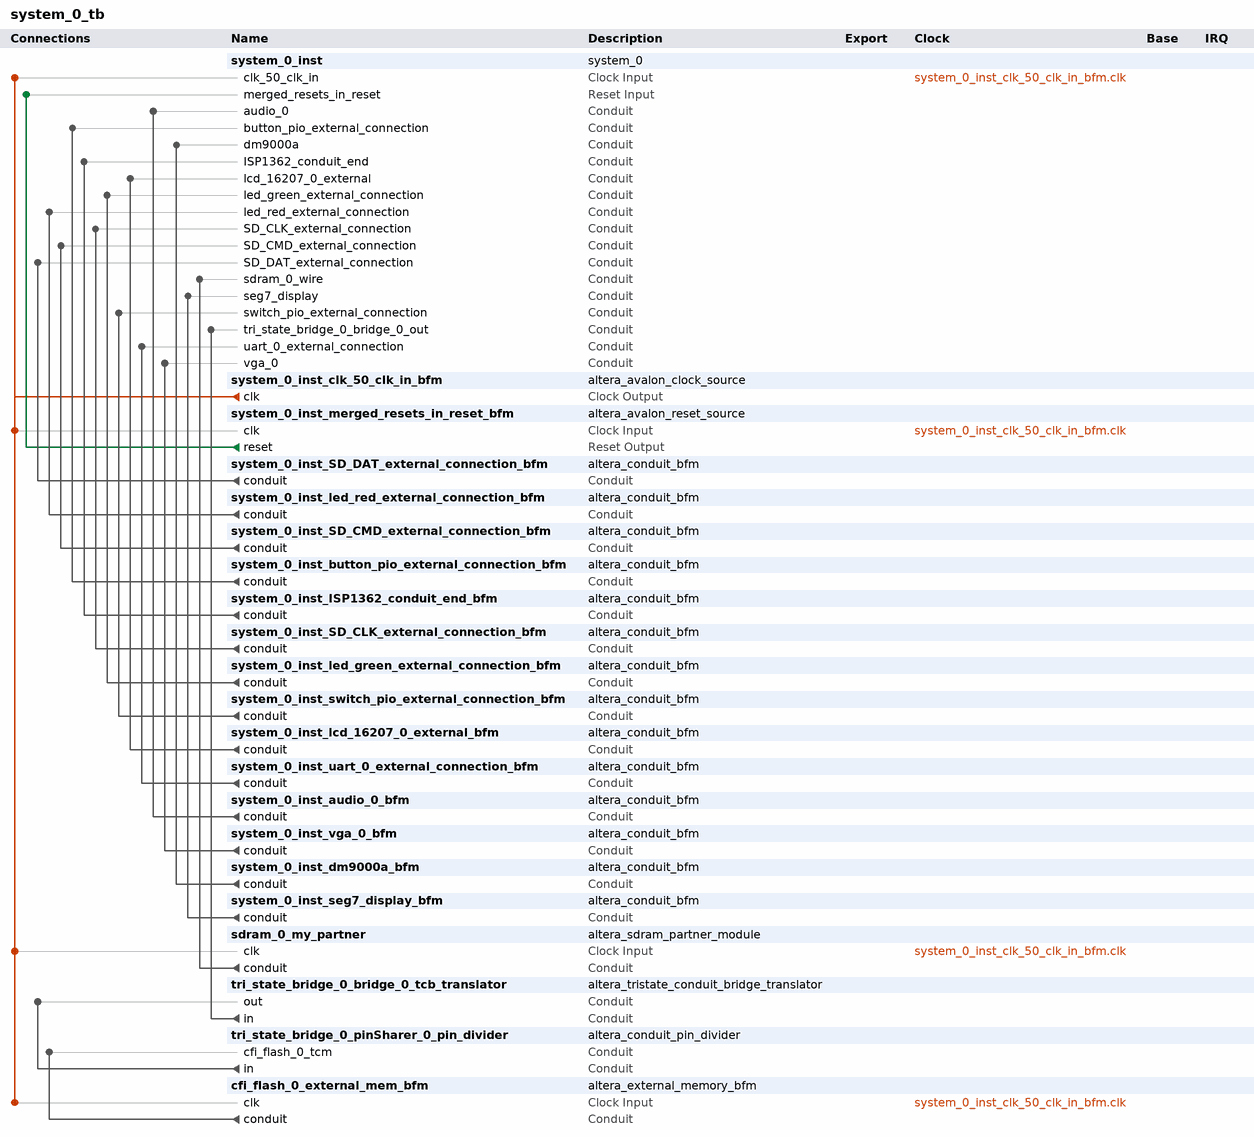
[diagram p0: system contents]
# Platform Designer (Qsys) system system_0_tb, Cyclone II EP2C35F672C6
# Parameters at their usual value, and those the tool derives, are not listed.
package require -exact qsys 13.0
create_system system_0_tb
set_project_property DEVICE_FAMILY {Cyclone II}
set_project_property DEVICE EP2C35F672C6

add_instance system_0_inst system_0 1.0

add_instance system_0_inst_clk_50_clk_in_bfm altera_avalon_clock_source 13.0

add_instance system_0_inst_merged_resets_in_reset_bfm altera_avalon_reset_source 13.0
set_instance_parameter_value system_0_inst_merged_resets_in_reset_bfm ASSERT_HIGH_RESET 0
set_instance_parameter_value system_0_inst_merged_resets_in_reset_bfm INITIAL_RESET_CYCLES 50

add_instance system_0_inst_SD_DAT_external_connection_bfm altera_conduit_bfm 13.0
set_instance_parameter_value system_0_inst_SD_DAT_external_connection_bfm CLOCKED_SIGNAL false
set_instance_parameter_value system_0_inst_SD_DAT_external_connection_bfm ENABLE_RESET false
set_instance_parameter_value system_0_inst_SD_DAT_external_connection_bfm SIGNAL_WIDTHS 1
set_instance_parameter_value system_0_inst_SD_DAT_external_connection_bfm SIGNAL_DIRECTIONS bidir

add_instance system_0_inst_led_red_external_connection_bfm altera_conduit_bfm 13.0
set_instance_parameter_value system_0_inst_led_red_external_connection_bfm CLOCKED_SIGNAL false
set_instance_parameter_value system_0_inst_led_red_external_connection_bfm ENABLE_RESET false
set_instance_parameter_value system_0_inst_led_red_external_connection_bfm SIGNAL_WIDTHS 18
set_instance_parameter_value system_0_inst_led_red_external_connection_bfm SIGNAL_DIRECTIONS input

add_instance system_0_inst_SD_CMD_external_connection_bfm altera_conduit_bfm 13.0
set_instance_parameter_value system_0_inst_SD_CMD_external_connection_bfm CLOCKED_SIGNAL false
set_instance_parameter_value system_0_inst_SD_CMD_external_connection_bfm ENABLE_RESET false
set_instance_parameter_value system_0_inst_SD_CMD_external_connection_bfm SIGNAL_WIDTHS 1
set_instance_parameter_value system_0_inst_SD_CMD_external_connection_bfm SIGNAL_DIRECTIONS bidir

add_instance system_0_inst_button_pio_external_connection_bfm altera_conduit_bfm 13.0
set_instance_parameter_value system_0_inst_button_pio_external_connection_bfm CLOCKED_SIGNAL false
set_instance_parameter_value system_0_inst_button_pio_external_connection_bfm ENABLE_RESET false
set_instance_parameter_value system_0_inst_button_pio_external_connection_bfm SIGNAL_WIDTHS 4
set_instance_parameter_value system_0_inst_button_pio_external_connection_bfm SIGNAL_DIRECTIONS output

add_instance system_0_inst_ISP1362_conduit_end_bfm altera_conduit_bfm 13.0
set_instance_parameter_value system_0_inst_ISP1362_conduit_end_bfm CLOCKED_SIGNAL false
set_instance_parameter_value system_0_inst_ISP1362_conduit_end_bfm ENABLE_RESET false
set_instance_parameter_value system_0_inst_ISP1362_conduit_end_bfm SIGNAL_ROLES DATA,ADDR,RD_N,WR_N,CS_N,RST_N,INT0,INT1
set_instance_parameter_value system_0_inst_ISP1362_conduit_end_bfm SIGNAL_WIDTHS 16,2,1,1,1,1,1,1
set_instance_parameter_value system_0_inst_ISP1362_conduit_end_bfm SIGNAL_DIRECTIONS bidir,input,input,input,input,input,output,output

add_instance system_0_inst_SD_CLK_external_connection_bfm altera_conduit_bfm 13.0
set_instance_parameter_value system_0_inst_SD_CLK_external_connection_bfm CLOCKED_SIGNAL false
set_instance_parameter_value system_0_inst_SD_CLK_external_connection_bfm ENABLE_RESET false
set_instance_parameter_value system_0_inst_SD_CLK_external_connection_bfm SIGNAL_WIDTHS 1
set_instance_parameter_value system_0_inst_SD_CLK_external_connection_bfm SIGNAL_DIRECTIONS input

add_instance system_0_inst_led_green_external_connection_bfm altera_conduit_bfm 13.0
set_instance_parameter_value system_0_inst_led_green_external_connection_bfm CLOCKED_SIGNAL false
set_instance_parameter_value system_0_inst_led_green_external_connection_bfm ENABLE_RESET false
set_instance_parameter_value system_0_inst_led_green_external_connection_bfm SIGNAL_WIDTHS 9
set_instance_parameter_value system_0_inst_led_green_external_connection_bfm SIGNAL_DIRECTIONS input

add_instance system_0_inst_switch_pio_external_connection_bfm altera_conduit_bfm 13.0
set_instance_parameter_value system_0_inst_switch_pio_external_connection_bfm CLOCKED_SIGNAL false
set_instance_parameter_value system_0_inst_switch_pio_external_connection_bfm ENABLE_RESET false
set_instance_parameter_value system_0_inst_switch_pio_external_connection_bfm SIGNAL_WIDTHS 18
set_instance_parameter_value system_0_inst_switch_pio_external_connection_bfm SIGNAL_DIRECTIONS output

add_instance system_0_inst_lcd_16207_0_external_bfm altera_conduit_bfm 13.0
set_instance_parameter_value system_0_inst_lcd_16207_0_external_bfm CLOCKED_SIGNAL false
set_instance_parameter_value system_0_inst_lcd_16207_0_external_bfm ENABLE_RESET false
set_instance_parameter_value system_0_inst_lcd_16207_0_external_bfm SIGNAL_ROLES RS,RW,data,E
set_instance_parameter_value system_0_inst_lcd_16207_0_external_bfm SIGNAL_WIDTHS 1,1,8,1
set_instance_parameter_value system_0_inst_lcd_16207_0_external_bfm SIGNAL_DIRECTIONS input,input,bidir,input

add_instance system_0_inst_uart_0_external_connection_bfm altera_conduit_bfm 13.0
set_instance_parameter_value system_0_inst_uart_0_external_connection_bfm CLOCKED_SIGNAL false
set_instance_parameter_value system_0_inst_uart_0_external_connection_bfm ENABLE_RESET false
set_instance_parameter_value system_0_inst_uart_0_external_connection_bfm SIGNAL_ROLES rxd,txd
set_instance_parameter_value system_0_inst_uart_0_external_connection_bfm SIGNAL_WIDTHS 1,1
set_instance_parameter_value system_0_inst_uart_0_external_connection_bfm SIGNAL_DIRECTIONS output,input

add_instance system_0_inst_audio_0_bfm altera_conduit_bfm 13.0
set_instance_parameter_value system_0_inst_audio_0_bfm CLOCKED_SIGNAL false
set_instance_parameter_value system_0_inst_audio_0_bfm ENABLE_RESET false
set_instance_parameter_value system_0_inst_audio_0_bfm SIGNAL_ROLES oAUD_DATA,oAUD_LRCK,oAUD_BCK,oAUD_XCK,iCLK_18_4
set_instance_parameter_value system_0_inst_audio_0_bfm SIGNAL_WIDTHS 1,1,1,1,1
set_instance_parameter_value system_0_inst_audio_0_bfm SIGNAL_DIRECTIONS input,input,input,input,output

add_instance system_0_inst_vga_0_bfm altera_conduit_bfm 13.0
set_instance_parameter_value system_0_inst_vga_0_bfm CLOCKED_SIGNAL false
set_instance_parameter_value system_0_inst_vga_0_bfm ENABLE_RESET false
set_instance_parameter_value system_0_inst_vga_0_bfm SIGNAL_ROLES VGA_R,VGA_G,VGA_B,VGA_HS,VGA_VS,VGA_SYNC,VGA_BLANK,VGA_CLK,iCLK_25
set_instance_parameter_value system_0_inst_vga_0_bfm SIGNAL_WIDTHS 10,10,10,1,1,1,1,1,1
set_instance_parameter_value system_0_inst_vga_0_bfm SIGNAL_DIRECTIONS input,input,input,input,input,input,input,input,output

add_instance system_0_inst_dm9000a_bfm altera_conduit_bfm 13.0
set_instance_parameter_value system_0_inst_dm9000a_bfm CLOCKED_SIGNAL false
set_instance_parameter_value system_0_inst_dm9000a_bfm ENABLE_RESET false
set_instance_parameter_value system_0_inst_dm9000a_bfm SIGNAL_ROLES iOSC_50,ENET_DATA,ENET_CMD,ENET_RD_N,ENET_WR_N,ENET_CS_N,ENET_RST_N,ENET_CLK,ENET_INT
set_instance_parameter_value system_0_inst_dm9000a_bfm SIGNAL_WIDTHS 1,16,1,1,1,1,1,1,1
set_instance_parameter_value system_0_inst_dm9000a_bfm SIGNAL_DIRECTIONS output,bidir,input,input,input,input,input,input,output

add_instance system_0_inst_seg7_display_bfm altera_conduit_bfm 13.0
set_instance_parameter_value system_0_inst_seg7_display_bfm CLOCKED_SIGNAL false
set_instance_parameter_value system_0_inst_seg7_display_bfm ENABLE_RESET false
set_instance_parameter_value system_0_inst_seg7_display_bfm SIGNAL_ROLES oSEG0,oSEG1,oSEG2,oSEG3,oSEG4,oSEG5,oSEG6,oSEG7
set_instance_parameter_value system_0_inst_seg7_display_bfm SIGNAL_WIDTHS 7,7,7,7,7,7,7,7
set_instance_parameter_value system_0_inst_seg7_display_bfm SIGNAL_DIRECTIONS input,input,input,input,input,input,input,input

add_instance sdram_0_my_partner altera_sdram_partner_module 11.0
set_instance_parameter_value sdram_0_my_partner SDRAM_DATA_WIDTH 16
set_instance_parameter_value sdram_0_my_partner SDRAM_COL_WIDTH 8
set_instance_parameter_value sdram_0_my_partner SDRAM_ROW_WIDTH 12
set_instance_parameter_value sdram_0_my_partner CONTR_NAME system_0_sdram_0

add_instance tri_state_bridge_0_bridge_0_tcb_translator altera_tristate_conduit_bridge_translator 13.0
set_instance_parameter_value tri_state_bridge_0_bridge_0_tcb_translator CHAIN_LENGTH 4
set_instance_parameter_value tri_state_bridge_0_bridge_0_tcb_translator MODULE_ORIGIN_LIST tri_state_bridge_0_pinSharer_0.tcm,tri_state_bridge_0_pinSharer_0.tcm,tri_state_bridge_0_pinSharer_0.tcm,tri_state_bridge_0_pinSharer_0.tcm,tri_state_bridge_0_pinSharer_0.tcm
set_instance_parameter_value tri_state_bridge_0_bridge_0_tcb_translator SIGNAL_ORIGIN_LIST tri_state_bridge_0_data,tri_state_bridge_0_readn,write_n_to_the_cfi_flash_0,tri_state_bridge_0_address,select_n_to_the_cfi_flash_0
set_instance_parameter_value tri_state_bridge_0_bridge_0_tcb_translator SIGNAL_ORIGIN_TYPE Bidirectional,Output,Output,Output,Output
set_instance_parameter_value tri_state_bridge_0_bridge_0_tcb_translator SIGNAL_ORIGIN_WIDTH 8,1,1,22,1

add_instance tri_state_bridge_0_pinSharer_0_pin_divider altera_conduit_pin_divider 13.0
set_instance_parameter_value tri_state_bridge_0_pinSharer_0_pin_divider CHAIN_LENGTH 4
set_instance_parameter_value tri_state_bridge_0_pinSharer_0_pin_divider MODULE_ORIGIN_LIST cfi_flash_0.tcm,cfi_flash_0.tcm,cfi_flash_0.tcm,cfi_flash_0.tcm,cfi_flash_0.tcm
set_instance_parameter_value tri_state_bridge_0_pinSharer_0_pin_divider SIGNAL_ORIGIN_LIST cfi_flash_0_tcm_address_out,cfi_flash_0_tcm_read_n_out,cfi_flash_0_tcm_write_n_out,cfi_flash_0_tcm_data_out,cfi_flash_0_tcm_chipselect_n_out
set_instance_parameter_value tri_state_bridge_0_pinSharer_0_pin_divider SIGNAL_ORIGIN_TYPE Output,Output,Output,Bidirectional,Output
set_instance_parameter_value tri_state_bridge_0_pinSharer_0_pin_divider SIGNAL_ORIGIN_WIDTH 22,1,1,8,1
set_instance_parameter_value tri_state_bridge_0_pinSharer_0_pin_divider SHARED_SIGNAL_LIST tri_state_bridge_0_address,tri_state_bridge_0_readn,write_n_to_the_cfi_flash_0,tri_state_bridge_0_data,select_n_to_the_cfi_flash_0

add_instance cfi_flash_0_external_mem_bfm altera_external_memory_bfm 13.0
set_instance_parameter_value cfi_flash_0_external_mem_bfm USE_BYTEENABLE 0
set_instance_parameter_value cfi_flash_0_external_mem_bfm USE_CHIPSELECT 1
set_instance_parameter_value cfi_flash_0_external_mem_bfm USE_WRITE 1
set_instance_parameter_value cfi_flash_0_external_mem_bfm USE_READ 1
set_instance_parameter_value cfi_flash_0_external_mem_bfm USE_OUTPUTENABLE 0
set_instance_parameter_value cfi_flash_0_external_mem_bfm USE_BEGINTRANSFER 0
set_instance_parameter_value cfi_flash_0_external_mem_bfm USE_RESET 0
set_instance_parameter_value cfi_flash_0_external_mem_bfm ACTIVE_LOW_BYTEENABLE 0
set_instance_parameter_value cfi_flash_0_external_mem_bfm ACTIVE_LOW_CHIPSELECT 1
set_instance_parameter_value cfi_flash_0_external_mem_bfm ACTIVE_LOW_WRITE 1
set_instance_parameter_value cfi_flash_0_external_mem_bfm ACTIVE_LOW_READ 1
set_instance_parameter_value cfi_flash_0_external_mem_bfm ACTIVE_LOW_OUTPUTENABLE 0
set_instance_parameter_value cfi_flash_0_external_mem_bfm ACTIVE_LOW_BEGINTRANSFER 0
set_instance_parameter_value cfi_flash_0_external_mem_bfm ACTIVE_LOW_RESET 0
set_instance_parameter_value cfi_flash_0_external_mem_bfm SIGNAL_ADDRESS_ROLES tcm_address_out
set_instance_parameter_value cfi_flash_0_external_mem_bfm SIGNAL_DATA_ROLES tcm_data_out
set_instance_parameter_value cfi_flash_0_external_mem_bfm SIGNAL_WRITE_ROLES tcm_write_n_out
set_instance_parameter_value cfi_flash_0_external_mem_bfm SIGNAL_READ_ROLES tcm_read_n_out
set_instance_parameter_value cfi_flash_0_external_mem_bfm SIGNAL_BYTEENABLE_ROLES tcm_byteenable_out
set_instance_parameter_value cfi_flash_0_external_mem_bfm SIGNAL_CHIPSELECT_ROLES tcm_chipselect_n_out
set_instance_parameter_value cfi_flash_0_external_mem_bfm SIGNAL_OUTPUTENABLE_ROLES tcm_outputenable_out
set_instance_parameter_value cfi_flash_0_external_mem_bfm SIGNAL_BEGINTRANSFER_ROLES tcm_begintransfer_out
set_instance_parameter_value cfi_flash_0_external_mem_bfm SIGNAL_RESET_ROLES tcm_reset_out
set_instance_parameter_value cfi_flash_0_external_mem_bfm CDT_ADDRESS_W 22
set_instance_parameter_value cfi_flash_0_external_mem_bfm CDT_SYMBOL_W 8
set_instance_parameter_value cfi_flash_0_external_mem_bfm CDT_NUMSYMBOLS 1
set_instance_parameter_value cfi_flash_0_external_mem_bfm INIT_FILE altera_external_memory_bfm.hex
set_instance_parameter_value cfi_flash_0_external_mem_bfm CDT_READ_LATENCY 0
set_instance_parameter_value cfi_flash_0_external_mem_bfm VHDL_ID 0

# connections
add_connection system_0_inst_clk_50_clk_in_bfm.clk cfi_flash_0_external_mem_bfm.clk clock
add_connection system_0_inst_clk_50_clk_in_bfm.clk sdram_0_my_partner.clk clock
add_connection system_0_inst_clk_50_clk_in_bfm.clk system_0_inst.clk_50_clk_in clock
add_connection system_0_inst_clk_50_clk_in_bfm.clk system_0_inst_merged_resets_in_reset_bfm.clk clock
add_connection system_0_inst_merged_resets_in_reset_bfm.reset system_0_inst.merged_resets_in_reset reset
add_connection cfi_flash_0_external_mem_bfm.conduit tri_state_bridge_0_pinSharer_0_pin_divider.cfi_flash_0_tcm conduit
add_connection sdram_0_my_partner.conduit system_0_inst.sdram_0_wire conduit
add_connection system_0_inst_audio_0_bfm.conduit system_0_inst.audio_0 conduit
add_connection system_0_inst_button_pio_external_connection_bfm.conduit system_0_inst.button_pio_external_connection conduit
add_connection system_0_inst_dm9000a_bfm.conduit system_0_inst.dm9000a conduit
add_connection system_0_inst_ISP1362_conduit_end_bfm.conduit system_0_inst.ISP1362_conduit_end conduit
add_connection system_0_inst_lcd_16207_0_external_bfm.conduit system_0_inst.lcd_16207_0_external conduit
add_connection system_0_inst_led_green_external_connection_bfm.conduit system_0_inst.led_green_external_connection conduit
add_connection system_0_inst_led_red_external_connection_bfm.conduit system_0_inst.led_red_external_connection conduit
add_connection system_0_inst_SD_CLK_external_connection_bfm.conduit system_0_inst.SD_CLK_external_connection conduit
add_connection system_0_inst_SD_CMD_external_connection_bfm.conduit system_0_inst.SD_CMD_external_connection conduit
add_connection system_0_inst_SD_DAT_external_connection_bfm.conduit system_0_inst.SD_DAT_external_connection conduit
add_connection system_0_inst_seg7_display_bfm.conduit system_0_inst.seg7_display conduit
add_connection system_0_inst_switch_pio_external_connection_bfm.conduit system_0_inst.switch_pio_external_connection conduit
add_connection system_0_inst_uart_0_external_connection_bfm.conduit system_0_inst.uart_0_external_connection conduit
add_connection system_0_inst_vga_0_bfm.conduit system_0_inst.vga_0 conduit
add_connection tri_state_bridge_0_bridge_0_tcb_translator.in system_0_inst.tri_state_bridge_0_bridge_0_out conduit
add_connection tri_state_bridge_0_pinSharer_0_pin_divider.in tri_state_bridge_0_bridge_0_tcb_translator.out conduit

set_interconnect_requirement {$system} qsys_mm.clockCrossingAdapter HANDSHAKE
set_interconnect_requirement {$system} qsys_mm.maxAdditionalLatency 1

save_system system_0_tb.qsys
